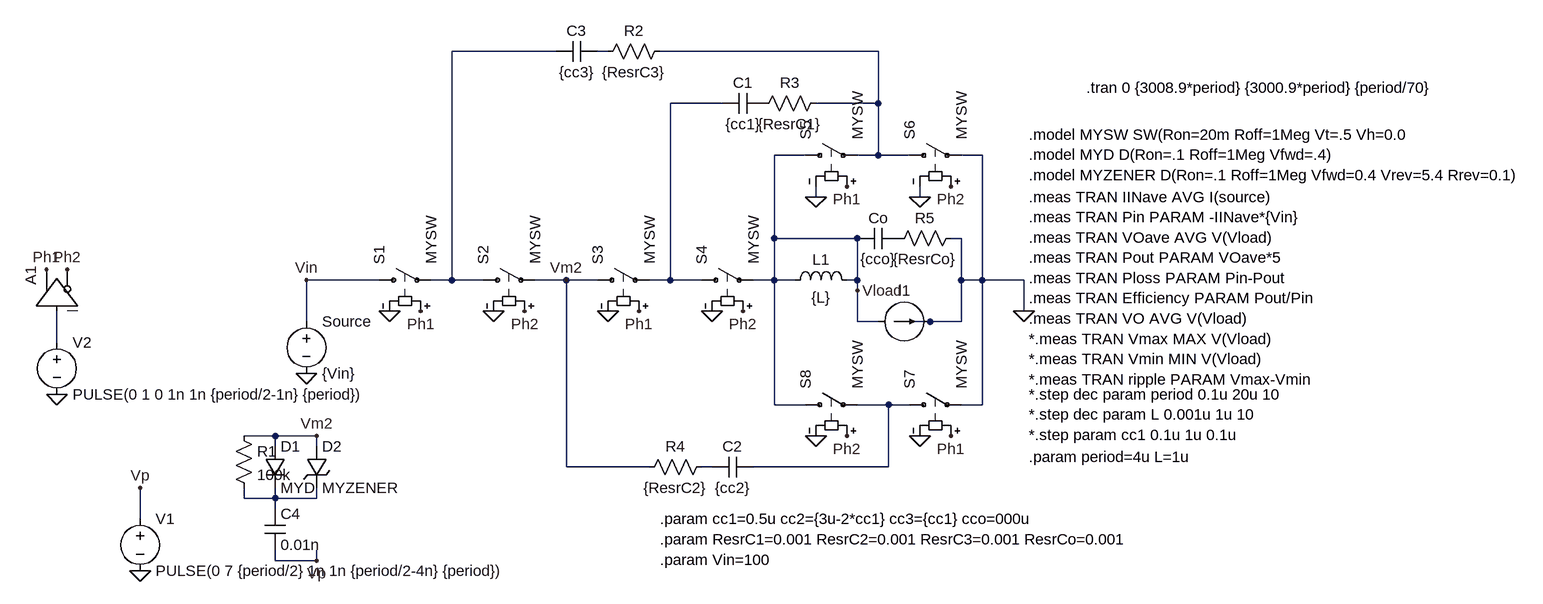
[diagram p0: schematic 4to1_dickson_level_shifting.asc]
4to1_dickson_level_shifting.asc, the LTspice schematic file:
Version 4
SHEET 1 1688 680
WIRE -48 -272 -208 -272
WIRE 32 -272 16 -272
WIRE 448 -272 112 -272
WIRE 208 -192 128 -192
WIRE 448 -192 448 -272
WIRE 448 -192 352 -192
WIRE 336 -112 288 -112
WIRE 448 -112 448 -192
WIRE 448 -112 416 -112
WIRE 496 -112 448 -112
WIRE 608 -112 576 -112
WIRE 352 -48 352 -64
WIRE 512 -48 512 -64
WIRE 288 16 288 -112
WIRE 416 16 288 16
WIRE 576 16 560 16
WIRE -320 80 -432 80
WIRE -208 80 -208 -272
WIRE -208 80 -240 80
WIRE -160 80 -208 80
WIRE -32 80 -80 80
WIRE 16 80 -32 80
WIRE 128 80 128 -192
WIRE 128 80 96 80
WIRE 176 80 128 80
WIRE 288 80 288 16
WIRE 288 80 256 80
WIRE 320 80 288 80
WIRE 416 80 416 16
WIRE 416 80 400 80
WIRE 576 80 576 16
WIRE 608 80 608 -112
WIRE 608 80 576 80
WIRE 672 80 608 80
WIRE 416 96 416 80
WIRE 672 128 672 80
WIRE -432 144 -432 80
WIRE 416 144 416 96
WIRE 448 144 416 144
WIRE 528 144 496 144
WIRE 576 144 576 80
WIRE 576 144 528 144
WIRE -816 176 -816 128
WIRE 288 272 288 80
WIRE 336 272 288 272
WIRE 464 272 416 272
WIRE 496 272 464 272
WIRE 608 272 608 80
WIRE 608 272 576 272
WIRE -480 320 -528 320
WIRE -416 320 -480 320
WIRE -480 336 -480 320
WIRE -416 336 -416 320
WIRE -32 368 -32 80
WIRE 96 368 -32 368
WIRE 192 368 176 368
WIRE 464 368 464 272
WIRE 464 368 256 368
WIRE -528 416 -528 400
WIRE -480 416 -480 400
WIRE -480 416 -528 416
WIRE -416 416 -416 400
WIRE -416 416 -480 416
WIRE -480 432 -480 416
WIRE -688 448 -688 400
WIRE -480 512 -480 496
WIRE -416 512 -416 496
WIRE -416 512 -480 512
FLAG -816 256 0
FLAG -832 64 Ph1
FLAG -800 64 Ph2
FLAG -432 224 0
FLAG -256 128 Ph1
FLAG 80 128 Ph1
FLAG 400 -64 Ph1
FLAG 560 320 Ph1
FLAG -96 128 Ph2
FLAG 240 128 Ph2
FLAG 560 -64 Ph2
FLAG 400 320 Ph2
FLAG -304 128 0
FLAG -144 128 0
FLAG 32 128 0
FLAG 192 128 0
FLAG 352 -48 0
FLAG 352 320 0
FLAG 512 -48 0
FLAG 512 320 0
FLAG 672 128 0
FLAG -432 80 Vin
FLAG 416 96 Vload
FLAG -32 80 Vm2
FLAG -416 320 Vm2
FLAG -688 528 0
FLAG -688 400 Vp
FLAG -416 512 Vp
SYMBOL voltage -816 160 R0
WINDOW 123 0 0 Left 2
WINDOW 39 0 0 Left 2
SYMATTR InstName V2
SYMATTR Value PULSE(0 1 0 1n 1n {period/2-1n} {period})
SYMBOL Digital\\buf -880 128 R270
SYMATTR InstName A1
SYMBOL voltage -432 128 R0
WINDOW 123 0 0 Left 2
WINDOW 39 0 0 Left 2
SYMATTR InstName Source
SYMATTR Value {Vin}
SYMBOL sw -336 80 R270
SYMATTR InstName S1
SYMATTR Value MYSW
SYMBOL sw -176 80 R270
SYMATTR InstName S2
SYMATTR Value MYSW
SYMBOL sw 0 80 R270
SYMATTR InstName S3
SYMATTR Value MYSW
SYMBOL sw 160 80 R270
SYMATTR InstName S4
SYMATTR Value MYSW
SYMBOL sw 320 -112 R270
SYMATTR InstName S5
SYMATTR Value MYSW
SYMBOL sw 480 -112 R270
SYMATTR InstName S6
SYMATTR Value MYSW
SYMBOL sw 480 272 R270
SYMATTR InstName S7
SYMATTR Value MYSW
SYMBOL sw 320 272 R270
SYMATTR InstName S8
SYMATTR Value MYSW
SYMBOL cap -48 -256 R270
WINDOW 0 32 32 VTop 2
WINDOW 3 0 32 VBottom 2
SYMATTR InstName C3
SYMATTR Value {cc3}
SYMATTR SpiceLine ic={Vin/4*3}
SYMBOL cap 208 -176 R270
WINDOW 0 32 32 VTop 2
WINDOW 3 0 32 VBottom 2
SYMATTR InstName C1
SYMATTR Value {cc1}
SYMATTR SpiceLine ic={Vin/4*1}
SYMBOL cap 192 384 R270
WINDOW 0 32 32 VTop 2
WINDOW 3 0 32 VBottom 2
SYMATTR InstName C2
SYMATTR Value {cc2}
SYMATTR SpiceLine ic={Vin/4*2}
SYMBOL cap 480 0 R90
WINDOW 0 0 32 VBottom 2
WINDOW 3 32 32 VTop 2
SYMATTR InstName Co
SYMATTR Value {cco}
SYMBOL res 16 -256 R270
WINDOW 0 32 56 VTop 2
WINDOW 3 0 56 VBottom 2
SYMATTR InstName R2
SYMATTR Value {ResrC3}
SYMBOL res 256 -176 R270
WINDOW 0 32 56 VTop 2
WINDOW 3 0 56 VBottom 2
SYMATTR InstName R3
SYMATTR Value {ResrC1}
SYMBOL res 80 384 R270
WINDOW 0 32 56 VTop 2
WINDOW 3 0 56 VBottom 2
SYMATTR InstName R4
SYMATTR Value {ResrC2}
SYMBOL res 464 32 R270
WINDOW 0 32 56 VTop 2
WINDOW 3 0 56 VBottom 2
SYMATTR InstName R5
SYMATTR Value {ResrCo}
SYMBOL current 448 144 R270
WINDOW 0 32 40 VTop 2
WINDOW 3 -32 40 Invisible 2
WINDOW 123 0 0 Left 2
WINDOW 39 0 0 Left 2
SYMATTR InstName I1
SYMATTR Value PULSE(0 5 {5*period} {100*period} 0 100 100 1)
SYMBOL ind 304 96 R270
WINDOW 0 32 56 VTop 2
WINDOW 3 5 56 VBottom 2
SYMATTR InstName L1
SYMATTR Value {L}
SYMBOL diode -496 336 R0
SYMATTR InstName D1
SYMATTR Value MYD
SYMBOL cap -496 432 R0
SYMATTR InstName C4
SYMATTR Value 0.01n
SYMBOL voltage -688 432 R0
WINDOW 123 0 0 Left 2
WINDOW 39 0 0 Left 2
SYMATTR InstName V1
SYMATTR Value PULSE(0 7 {period/2} 1n 1n {period/2-4n} {period})
SYMBOL zener -432 336 R0
SYMATTR InstName D2
SYMATTR Value MYZENER
SYMBOL res -544 304 R0
SYMATTR InstName R1
SYMATTR Value 100k
TEXT 768 -216 Left 2 !.tran 0 {3008.9*period} {3000.9*period} {period/70}
TEXT 680 -144 Left 2 !.model MYSW SW(Ron=20m Roff=1Meg Vt=.5 Vh=0.0\n.model MYD D(Ron=.1 Roff=1Meg Vfwd=.4)\n.model MYZENER D(Ron=.1 Roff=1Meg Vfwd=0.4 Vrev=5.4 Rrev=0.1)
TEXT 680 -48 Left 2 !.meas TRAN IINave AVG I(source)\n.meas TRAN Pin PARAM -IINave*{Vin}\n.meas TRAN VOave AVG V(Vload)\n.meas TRAN Pout PARAM VOave*5\n.meas TRAN Ploss PARAM Pin-Pout\n.meas TRAN Efficiency PARAM Pout/Pin\n.meas TRAN VO AVG V(Vload)\n*.meas TRAN Vmax MAX V(Vload)\n*.meas TRAN Vmin MIN V(Vload)\n*.meas TRAN ripple PARAM Vmax-Vmin
TEXT 112 448 Left 2 !.param cc1=0.5u cc2={3u-2*cc1} cc3={cc1} cco=000u\n.param ResrC1=0.001 ResrC2=0.001 ResrC3=0.001 ResrCo=0.001\n.param Vin=100
TEXT 680 256 Left 2 !*.step dec param period 0.1u 20u 10\n*.step dec param L 0.001u 1u 10\n*.step param cc1 0.1u 1u 0.1u
TEXT 680 352 Left 2 !.param period=4u L=1u

The netlist it stands for:
* 4to1_dickson_level_shifting.asc
V2 N005 0 PULSE(0 1 0 1n 1n {period/2-1n} {period})
A1 N005 0 0 0 0 Ph2 Ph1 0 BUF
V§Source Vin 0 {Vin}
S1 Vin N001 Ph1 0 MYSW
S2 N001 Vm2 Ph2 0 MYSW
S3 Vm2 N004 Ph1 0 MYSW
S4 N004 Vload Ph2 0 MYSW
S5 Vload N003 Ph1 0 MYSW
S6 N003 0 Ph2 0 MYSW
S7 N006 0 Ph1 0 MYSW
S8 Vload N006 Ph2 0 MYSW
C3 N001 N002 {cc3} ic={Vin/4*3}
C1 N004 P001 {cc1} ic={Vin/4*1}
C2 N007 N006 {cc2} ic={Vin/4*2}
Co P002 Vload {cco}
R2 N002 N003 {ResrC3}
R3 P001 N003 {ResrC1}
R4 Vm2 N007 {ResrC2}
R5 P002 0 {ResrCo}
I1 Vload 0 PULSE(0 5 {5*period} {100*period} 0 100 100 1)
L1 Vload Vload {L}
D1 Vm2 N008 MYD
C4 N008 Vp 0.01n
V1 Vp 0 PULSE(0 7 {period/2} 1n 1n {period/2-4n} {period})
D2 Vm2 N008 MYZENER
R1 Vm2 N008 100k
.model D D
.lib standard.dio
.tran 0 {3008.9*period} {3000.9*period} {period/70}
.model MYSW SW(Ron=20m Roff=1Meg Vt=.5 Vh=0.0
.model MYD D(Ron=.1 Roff=1Meg Vfwd=.4)
.model MYZENER D(Ron=.1 Roff=1Meg Vfwd=0.4 Vrev=5.4 Rrev=0.1)
.meas TRAN IINave AVG I(source)
.meas TRAN Pin PARAM -IINave*{Vin}
.meas TRAN VOave AVG V(Vload)
.meas TRAN Pout PARAM VOave*5
.meas TRAN Ploss PARAM Pin-Pout
.meas TRAN Efficiency PARAM Pout/Pin
.meas TRAN VO AVG V(Vload)
*.meas TRAN Vmax MAX V(Vload)
*.meas TRAN Vmin MIN V(Vload)
*.meas TRAN ripple PARAM Vmax-Vmin
.param cc1=0.5u cc2={3u-2*cc1} cc3={cc1} cco=000u
.param ResrC1=0.001 ResrC2=0.001 ResrC3=0.001 ResrCo=0.001
.param Vin=100
*.step dec param period 0.1u 20u 10
*.step dec param L 0.001u 1u 10
*.step param cc1 0.1u 1u 0.1u
.param period=4u L=1u
.backanno
.end